# EAGLE schematic schematic-v1 (EAGLE 9.6.2)
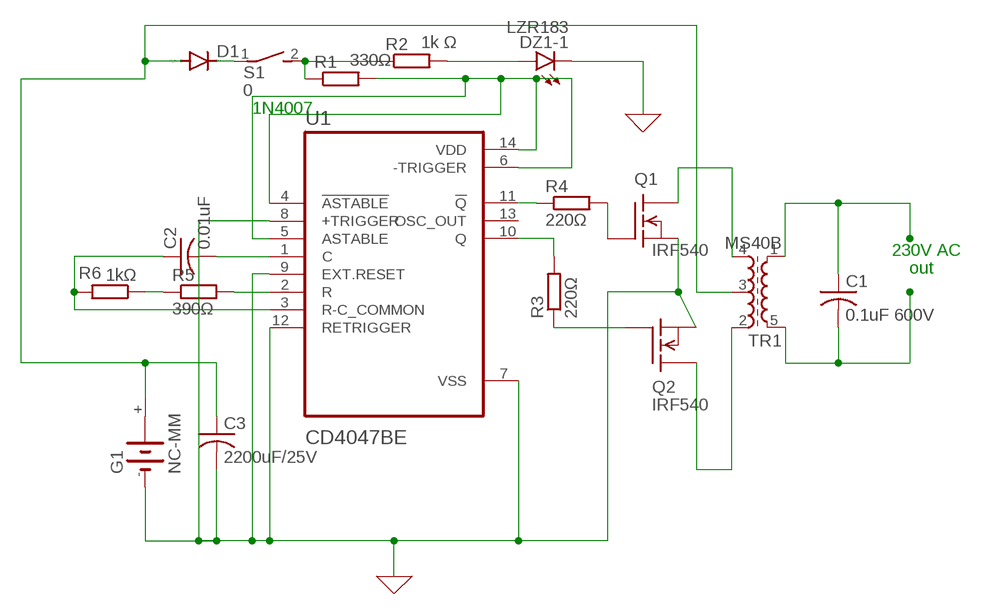
[diagram p0: schematic, sheet 1]

## Parts
C1  0.1uF 600V  C-US025-024X044  [C025-024X044]
C2  0.01uF  C-US025-024X044  [C025-024X044]
C3  2200uF/25V  C-US025-024X044  [C025-024X044]
D1  1N4004  [DO41-10]
DZ1  LZR183  [LZR183]
G1  NC-MM  [NC-MM]
Q1  IRF540  [TO220]
Q2  IRF540  [TO220]
R1  330Ω  R-EU_0207/7  [0207/7]
R2  1k Ω  R-EU_0207/7  [0207/7]
R3  220Ω  R-EU_0207/7  [0207/7]
R4  220Ω  R-EU_0207/7  [0207/7]
R5  390Ω  R-EU_0207/7  [0207/7]
R6  1kΩ  R-EU_0207/7  [0207/7]
S1  0  DS01E  [DS-01]
TR1  MS40B  [MS40]
U1  CD4047BE  [DIP794W45P254L1969H508Q14]

## Nets
0: C3.2 DZ1.K1(-1:C) G1.- Q1.3(S) Q2.3(S) U1.7(VSS) U1.8(+TRIGGER) U1.9(EXT.RESET) U1.12(RETRIGGER) ; supply symbol labelled GND
N$2: C2.2 U1.1(C)
N$3: R3.2 U1.10(Q)
N$4: Q2.1(G) R3.1
N$5: C3.1 D1.A G1.+ TR1.3
N$6: Q2.2(D) TR1.2
N$7: Q1.2(D) TR1.4
N$8: C1.2 TR1.5
N$9: C1.1 TR1.1
N$10: R1.1 R2.1 S1.2
N$11: R1.2 U1.4(!ASTABLE) U1.5(ASTABLE) U1.6(-TRIGGER) U1.14(VDD)
N$12: DZ1.A1(-1:A) R2.2
N$13: R5.2 U1.2(R)
N$14: C2.1 R6.2 U1.3(R-C_COMMON)
N$15: R5.1 R6.1
N$16: R4.1 U1.11(!Q)
N$17: Q1.1(G) R4.2
N$18: D1.C S1.1
Unconnected: DZ1.A2(-2:A) DZ1.A3(-3:A) DZ1.K2(-2:C) DZ1.K3(-3:C) G1.+@1(+) U1.13(OSC_OUT)

## Notes on the sheet
- 1N4007
- 230V AC
- out

## Library data of the parts
C1-C3 = rcl:C-US: CAPACITOR, American symbol; SPICEPREFIX: C
D1 = diode:1N4004: DIODE general purpose rectifier, 1 A
DZ1 = led:LZR183: LED BLOCK 3 LEDs, Siemens
G1 = battery:NC-MM: NC ACCU Sonnenschein Mini-Memo NC-MM 2.4 to 4.8 R5 Sonnenschein
Q1 Q2 = transistor-fet:IRF540: N-Channel Enhancement MOSFET (HEXFET); 100V; 28A; 0,077Ohm
R1-R6 = rcl:R-EU_: RESISTOR, European symbol; SPICEPREFIX: R
S1 = switch-dil:DS01E: DIL/CODE SWITCH; OC_FARNELL: unknown; OC_NEWARK: unknown
TR1 = inductor-neosid:MS40: TRANSFORMER SMD transformer acc. to customer specification; OC_FARNELL: unknown; OC_NEWARK: unknown
U1 = CD4047BE:CD4047BE: Check availability <https://pricing.snapeda.com/parts/CD4047BE/Texas%20Instruments/view-part?ref=eda>; AVAILABILITY: In Stock; CHECK_PRICES: https://www.snapeda.com/parts/CD4047BE/Texas+Instruments/view-part/?ref=eda; DESCRIPTION: CMOS Low-Power Monostable/Astable Multivibrator; MF: Texas Instruments; MP: CD4047BE; PACKAGE: PDIP-14 Texas Instruments; PRICE: None; PURCHASE-URL: https://www.snapeda.com/api/url_track_click_mouser/?unipart_id=105099&manufacturer=Texas Instruments&part_name=CD4047BE&search_term=None; SNAPEDA_LINK: https://www.snapeda.com/parts/CD4047BE/Texas+Instruments/view-part/?ref=snap

## Module 16
Ports: 

### Library data of the parts